# Altium schematic sheet ADC_channel.SchDoc
size A4
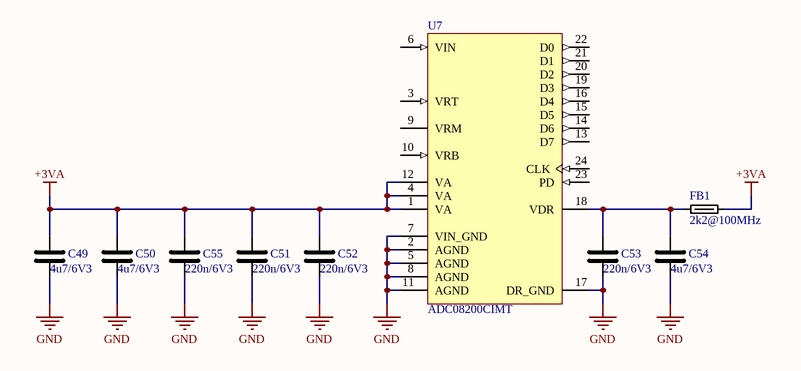
[diagram p0: ADC_channel.SchDoc]

## Parts
C49  4u7/6V3  [C0805_N]
C50  4u7/6V3  [C0805_N]
C51  220n/6V3  [C0402_N]
C52  220n/6V3  [C0402_N]
C53  220n/6V3  [C0402_N]
C54  4u7/6V3  [C0805_N]
C55  220n/6V3  [C0402_N]
FB1  value 2k2@100MHz  [L0805_N]  (hidden comment: HZ0805B222R-10)
U7  ADC08200CIMT  [National_TSSOP24_N]

## Nets
+3VA: C49.2 C50.2 C51.2 C52.2 C55.2 FB1.2 U7.1(VA) U7.4(VA) U7.12(VA)
GND: C49.1 C50.1 C51.1 C52.1 C53.1 C54.1 C55.1 U7.2(AGND) U7.5(AGND) U7.7(VIN_GND) U7.8(AGND) U7.11(AGND) U7.17(DR_GND)
NetC53_2: C53.2 C54.2 FB1.1 U7.18(VDR)

Not connected (* = marked no-connect by the designer): U7 3(VRT) 6(VIN) 9(VRM) 10(VRB) 13(D7) 14(D6) 15(D5) 16(D4) 19(D3) 20(D2) 21(D1) 22(D0) 23(PD) 24(CLK)

## Library data of the parts
C49-C55 = C
FB1 = HZ0805B222R-10: Ferrite Bead, 0805, 2200R@100MHz, 0.8R@DC, 200mA max.